# Altium project PCB_3U_Kasli.PrjPCB (part 4 of 7)

## Sheet SFP.SchDoc: =ProjectName
size 420 x 297 mm; Author: G.K.; CompanyName: WUT; DrawnBy: P.K.; Organization: WUT ISE; Address1: Warsaw Univeristy of Technology; Address2: Nowowiejska 15/19; DocumentNumber: 9; Revision: 1.1; SheetNumber: 9; SheetTotal: 12; EDA_Number: ARTIQ; Projet: ARTIQ/SINARA; ModifiedBy: -; CreateDate: XX/XX/XXXX; CheckedDate: -; Title2: SFP.SchDoc; DivGrp: ISE; Designer: G.K. and P.K.; ModifiedDate: -; ProjectName: ARTIQ/SINARA
Used 3 times, as channels U_SFP_0, U_SFP_1, U_SFP_2. Parts and nets are listed once, with the designators drawn on the sheet.
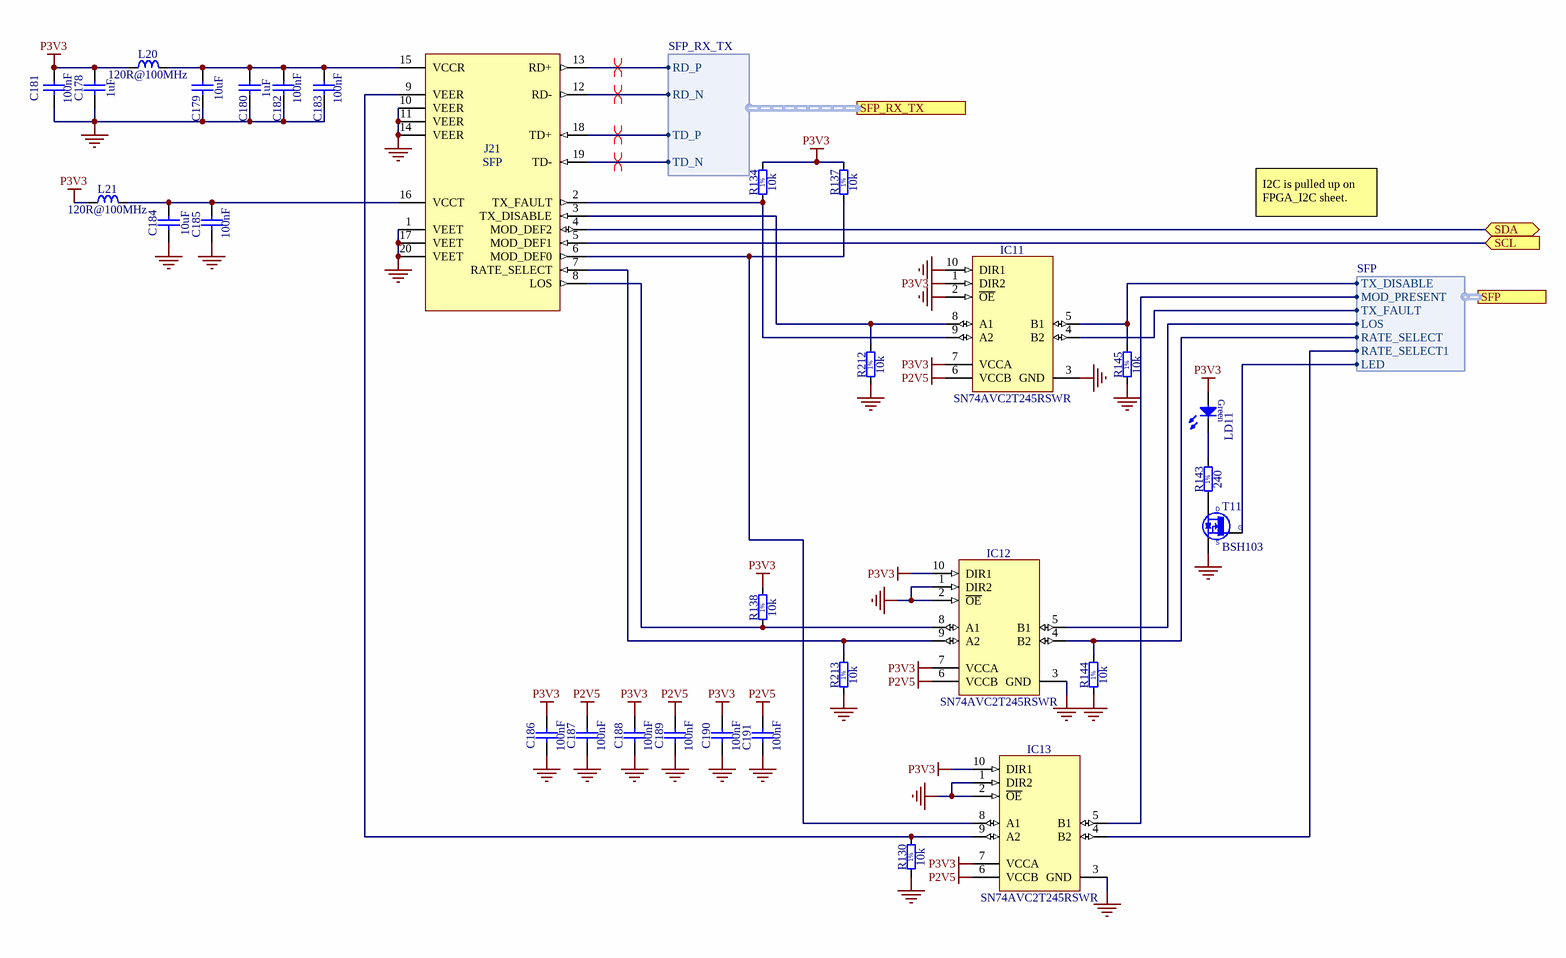
[diagram p4: SFP.SchDoc]

### Parts
C178  1uF  [CAPC1005X55N]
C179  10uF  [CAPC2012X95N]
C180  1uF  [CAPC1005X55N]
C181  100nF  [CAPC0603X33N]
C182  100nF  [CAPC0603X33N]
C183  100nF  [CAPC0603X33N]
C184  10uF  [CAPC2012X95N]
C185  100nF  [CAPC0603X33N]
C186  100nF  [CAPC0603X33N]
C187  100nF  [CAPC0603X33N]
C188  100nF  [CAPC0603X33N]
C189  100nF  [CAPC0603X33N]
C190  100nF  [CAPC0603X33N]
C191  100nF  [CAPC0603X33N]
IC11  SN74AVC2T245RSWR  [QFN40P140X180X55-10N]
IC12  SN74AVC2T245RSWR  [QFN40P140X180X55-10N]
IC13  SN74AVC2T245RSWR  [QFN40P140X180X55-10N]
J21  SFP  [TYCO_1367073-1]
L20  120R@100MHz  [INDC1608X65N]
L21  120R@100MHz  [INDC1608X65N]
LD11  Green  [LED_AVAGO_HSME-C120]  (value not drawn)
R130  10k  [RESC1005X40N]
R134  10k  [RESC1005X40N]
R137  10k  [RESC1005X40N]
R138  10k  [RESC1005X40N]
R143  240  [RESC1005X40N]
R144  10k  [RESC1005X40N]
R145  10k  [RESC1005X40N]
R212  10k  [RESC1005X40N]
R213  10k  [RESC1005X40N]
T11  BSH103  [SOT95P230X110-3N]

### Ports
SCL (in), SDA (bidir), SFP (harness SFP), SFP_RX_TX (harness SFP_RX_TX)

### Harnesses
SFP_RX_TX: RD_P, RD_N, TD_P, TD_N
SFP: TX_FAULT, LOS, MOD_PRESENT, TX_DISABLE, RATE_SELECT, LED, RATE_SELECT1

### Nets
GND: C178.1 C179.1 C180.1 C181.1 C182.1 C183.1 C184.1 C185.1 C186.1 C187.1 C188.1 C189.1 C190.1 C191.1 IC11.2(~{OE}) IC11.3(GND) IC11.10(DIR1) IC12.1(DIR2) IC12.2(~{OE}) IC12.3(GND) IC13.1(DIR2) IC13.2(~{OE}) IC13.3(GND) J21.1(VEET) J21.10(VEER) J21.11(VEER) J21.14(VEER) J21.17(VEET) J21.20(VEET) R130.1 R144.1 R145.1 R212.1 R213.1 T11.2(S)
P2V5: C187.2 C189.2 C191.2 IC11.6(VCCB) IC12.6(VCCB) IC13.6(VCCB)
P3V3: C178.2 C181.2 C186.2 C188.2 C190.2 IC11.1(DIR2) IC11.7(VCCA) IC12.7(VCCA) IC12.10(DIR1) IC13.7(VCCA) IC13.10(DIR1) L20.1 L21.1 LD11.2(A) R134.2 R137.2 R138.2
SCL: J21.5(MOD_DEF1) ; port SCL
SDA: J21.4(MOD_DEF2) ; port SDA
NetC179_2: C179.2 C180.2 C182.2 C183.2 J21.15(VCCR) L20.2
NetC184_2: C184.2 C185.2 J21.16(VCCT) L21.2
NetIC11_4: IC11.4(B2) ; port SFP.TX_FAULT
NetIC11_5: IC11.5(B1) R145.2 ; port SFP.TX_DISABLE
NetIC11_8: IC11.8(A1) J21.3(TX_DISABLE) R212.2
NetIC11_9: IC11.9(A2) J21.2(TX_FAULT) R134.1
NetIC12_4: IC12.4(B2) R144.2 ; port SFP.RATE_SELECT
NetIC12_5: IC12.5(B1) ; port SFP.LOS
NetIC12_8: IC12.8(A1) J21.8(LOS) R138.1
NetIC12_9: IC12.9(A2) J21.7(RATE_SELECT) R213.2
NetIC13_4: IC13.4(B2) ; port SFP.RATE_SELECT1
NetIC13_5: IC13.5(B1) ; port SFP.MOD_PRESENT
NetIC13_8: IC13.8(A1) J21.6(MOD_DEF0) R137.1
NetIC13_9: IC13.9(A2) J21.9(VEER) R130.2
NetJ21_12: J21.12(RD-) ; port SFP_RX_TX.RD_N
NetJ21_13: J21.13(RD+) ; port SFP_RX_TX.RD_P
NetJ21_18: J21.18(TD+) ; port SFP_RX_TX.TD_P
NetJ21_19: J21.19(TD-) ; port SFP_RX_TX.TD_N
NetLD11_1: LD11.1(C) R143.2
NetR143_1: R143.1 T11.3(D)
NetT11_1: T11.1(G) ; port SFP.LED

### Channels
U_SFP_0: designators end in A; ports SCL=SFP_0.SCL SDA=SFP_0.SDA
U_SFP_1: designators end in B; ports SCL=SFP_1.SCL SDA=SFP_1.SDA
U_SFP_2: designators end in C; ports SCL=SFP_2.SCL SDA=SFP_2.SDA

### Layout directives
differential pair; net class Diff_100Ohm: SFP_RX_TX_0.RD_N, SFP_RX_TX_0.RD_P, SFP_RX_TX_0.TD_N, SFP_RX_TX_0.TD_P

### Notes on the sheet
- I2C is pulled up on FPGA_I2C sheet.
- Project/Equipment
- Document
- Designer
- Drawn by
- Check.by
- File
- Last Mod.
- Print Date
- Sheet
- Size
- A3
- of
- Rev
- (in symbol R0402_10K_1%_0.0625W_100PPM) 1%
- (in symbol R0402_240R_1%_0.0625W_100PPM) 1%

### Library data of the parts
C178 C180 = CC0402_1UF_16V_10%_X5R: as C154 on sheet PowerSupplies; Part Number: CC0402_1UF_16V_10%_X5R; Component Kind: Standard; Component Type: Standard; Pin Count: 2; Value: 1uF; Status: Preferred; Manufacturer Part Number: CC0402_1UF_16V_10%_X5R; Case: 0402; Mounted: Yes; Socket: No; SMD: Yes; Sense: No; Manufacturer1 Example: TDK; Manufacturer1 ComponentHeight: 0.55mm; HelpURL: \\cern.ch\dfs\Applications\Altium\Datasheets\CC0402_X5R_TDK_C.pdf; Author: CERN DEM JLC; CreateDate: 2012-10-25; LatestRevisionDate: 2012-10-25
C179 C184 = CC0805_10UF_25V_10%_X5R: as C130 on sheet PowerSupplies; Part Number: CC0805_10UF_25V_10%_X5R; Component Kind: Standard; Component Type: Standard; Pin Count: 2; Value: 10uF; Status: Preferred; Manufacturer Part Number: CC0805_10UF_25V_10%_X5R; Case: 0805; Mounted: Yes; Socket: No; SMD: Yes; Sense: No; Manufacturer1 Example: MURATA; Manufacturer1 ComponentHeight: 0.95mm; HelpURL: \\cern.ch\dfs\Applications\Altium\Datasheets\CC0805_X5R_MURATA_GRM.pdf; Author: CERN DEM JLC; CreateDate: 25.10.2012; LatestRevisionDate: 06.09.2016
C181-C183 C185-C191 = CC0201_100NF_6.3V_10%_X5R: as C134 on sheet PowerSupplies; Part Number: CC0201_100NF_6.3V_10%_X5R; Component Kind: Standard; Component Type: Standard; Pin Count: 2; Value: 100nF; Status: Not Recommended; Manufacturer Part Number: CC0201_100NF_6.3V_10%_X5R; Case: 0201; Mounted: Yes; Socket: No; SMD: Yes; Sense: No; Manufacturer1 Example: AVX; Manufacturer1 ComponentHeight: 0.33mm; HelpURL: \\cern.ch\dfs\Applications\Altium\Datasheets\CC0201_X5R_AVX.pdf; Author: CERN DEM JLC; CreateDate: 2007-12-03; LatestRevisionDate: 2007-12-03
IC11-IC13 = SN74AVC2T245RSWR: Dual-Bit Dual-Supply Bus Transceiver With Configurable Voltage Translation and 3-State Outputs; Manufacturer: TEXAS INSTRUMENTS; PressFit: No; Bonding: No; Part Number: SN74AVC2T245RSWR; Component Kind: Standard; Component Type: Standard; Device: SN74AVC2T245RSWR; PackageDescription: QFN, 0.40mm Pitch, Rect.;10 Pin, 1.80mm L X 1.40mm W X 0.55mm H Body, IPC Medium Density; Status: Not Recommended; Part Description: Dual-Bit Dual-Supply Bus Transceiver With Configurable Voltage Translation and 3-State Outputs; Manufacturer Part Number: SN74AVC2T245RSWR; Pin Count: 10; Case: QFN10; Mounted: Yes; Socket: No; SMD: Yes; Sense: No; ComponentHeight: 0.55mm; Author: CERN DEM JLC; HelpURL: \\cern.ch\dfs\Applications\Altium\Datasheets\SN74AVC2T245RSWR.pdf; CreateDate: 07.07.2014; LatestRevisionDate: 30.03.2017
J21 = TYCO_1367073-1: 20 Position SFP  Connector (Small Form-factor Pluggable); Part Description: 20 Position, Pitch 0.8mm SFP Receptacle (Small Form-factor Pluggable); Manufacturer: TYCO ELECTRONICS; PressFit: No; Part Number: TYCO_1367073-1; Component Kind: Standard; Component Type: Standard; Pin Count: 20; Family: SFP; Mounted: Yes; Socket: No; SMD: Yes; Sense: No; Status: None; Manufacturer Part Number: 1367073-1; ComponentHeight: 5.4mm; ComponentLink1URL: \\cern.ch\dfs\Applications\Altium\Datasheets\TYCO_SFP_Application.pdf; ComponentLink1Description: Application; ComponentLink2URL: \\cern.ch\dfs\Applications\Altium\Datasheets\Tyco_SFP_Specification.pdf; ComponentLink2Description: SFP Specification; HelpURL: \\cern.ch\dfs\Applications\Altium\Datasheets\TYCO_1367073-1.pdf; Author: CERN DEM JLC; CreateDate: 25.01.2010; LatestRevisionDate: 25.01.2010
L20 L21 = IND0603_MURATA_BLM18SG121TN1D: as L7 on sheet PowerSupplies; Part Number: IND0603_MURATA_BLM18SG121TN1D; Component Kind: Standard; Component Type: Standard; Pin Count: 2; Value: 120R@100MHz; Status: None; Manufacturer Part Number: BLM18SG121TN1D; Case: 0603; Mounted: Yes; Socket: No; SMD: Yes; Sense: No; ComponentHeight: 0.65mm; HelpURL: \\cern.ch\dfs\Applications\Altium\Datasheets\IND0603_MURATA_BLM18S.pdf; Author: CERN DEM JLC; CreateDate: 23.07.2014; LatestRevisionDate: 23.07.2014
LD11 = LED_AVAGO_HSME-C120: LED Green 1C 2A; Part Description: High Performance Right Angle Chip Green LED; Manufacturer: AVAGO TECHNOLOGIES; PressFit: No; Bonding: No; Part Number: LED_AVAGO_HSME-C120; Component Kind: Standard; Component Type: Standard; Color: Green; PackageDescription: Green Chip LED, 2-Leads, Body 1.7x1.1mm, Side Emitting Package; Manufacturer Part Number: HSME-C120; Pin Count: 2; Mounted: Yes; Socket: No; SMD: Yes; Sense: No; ComponentHeight: 0.7mm; HelpURL: \\cern.ch\dfs\Applications\Altium\Datasheets\LED_AVAGO_HSME-C120.pdf; ComponentLink1URL: \\cern.ch\dfs\Applications\Altium\Datasheets\LED_AVAGO_HSME-C110_DESIGN-GUIDE.pdf; ComponentLink1Description: Design Guide; Author: CERN DEM JMW; CreateDate: 22.07.2009; LatestRevisionDate: 20.06.2012
R130 R134 R137 R138 R144 R145 R212 R213 = R0402_10K_1%_0.0625W_100PPM: as R51 on sheet PowerSupplies; Part Number: R0402_10K_1%_0.0625W_100PPM; Component Kind: Standard; Component Type: Standard; Pin Count: 2; Value: 10k; Status: Not Recommended; Power: 0.0625W; Tolerance: ±1%; Manufacturer Part Number: R0402_10K_1%_0.0625W_100PPM; Case: 0402; Mounted: Yes; Sense: No; Socket: No; SMD: Yes; Manufacturer1 Example: YAGEO PHYCOMP; Manufacturer1 ComponentHeight: 0.4mm; HelpURL: \\cern.ch\dfs\Applications\Altium\Datasheets\R0402_Phycomp_RC0402.pdf; Author: CERN DEM JLC; CreateDate: 03.12.2007; LatestRevisionDate: 17.10.2012
R143 = R0402_240R_1%_0.0625W_100PPM: as R69 on sheet PowerSupplies; Part Number: R0402_240R_1%_0.0625W_100PPM; Component Kind: Standard; Component Type: Standard; Pin Count: 2; Value: 240; Status: Not Recommended; Power: 0.0625W; Tolerance: ±1%; Manufacturer Part Number: R0402_240R_1%_0.0625W_100PPM; Case: 0402; Mounted: Yes; Sense: No; Socket: No; SMD: Yes; Manufacturer1 Example: YAGEO PHYCOMP; Manufacturer1 ComponentHeight: 0.4mm; HelpURL: \\cern.ch\dfs\Applications\Altium\Datasheets\R0402_Phycomp_RC0402.pdf; Author: CERN DEM JLC; CreateDate: 03.12.2007; LatestRevisionDate: 17.10.2012
T11 = BSH103: as T6-T10 on sheet PowerSupplies; Part Number: BSH103; Component Kind: Standard; Component Type: Standard; Device: BSH103; PackageDescription: SOT23, 3 pin, Pitch 0.95mm - 1.3mm W X 2.9mm L X 1.1mm H, IPC Medium Density; Manufacturer Part Number: BSH103; Pin Count: 3; Case: SOT23-3; Mounted: Yes; Socket: No; SMD: Yes; Sense: No; ComponentHeight: 1.1mm; HelpURL: \\cern.ch\dfs\Applications\Altium\Datasheets\BSH103.pdf; Author: CERN DEM JLC; CreateDate: 16.03.2010; LatestRevisionDate: 20.06.2017

## Sheet BackplaneConnector.SchDoc: =ProjectName
size 420 x 297 mm; Author: G.K.; CompanyName: WUT; DrawnBy: G.K. and P.K.; Organization: WUT ISE; Address1: Warsaw Univeristy of Technology; Address2: Nowowiejska 15/19; DocumentNumber: 7; Revision: 1.1; SheetNumber: 7; SheetTotal: 12; EDA_Number: ARTIQ; Projet: ARTIQ/SINARA; ModifiedBy: -; CreateDate: XX/XX/XXXX; CheckedDate: -; Title2: BackplaneConnector.SchDoc; DivGrp: ISE; Designer: G.K.; ModifiedDate: -; ProjectName: ARTIQ/SINARA
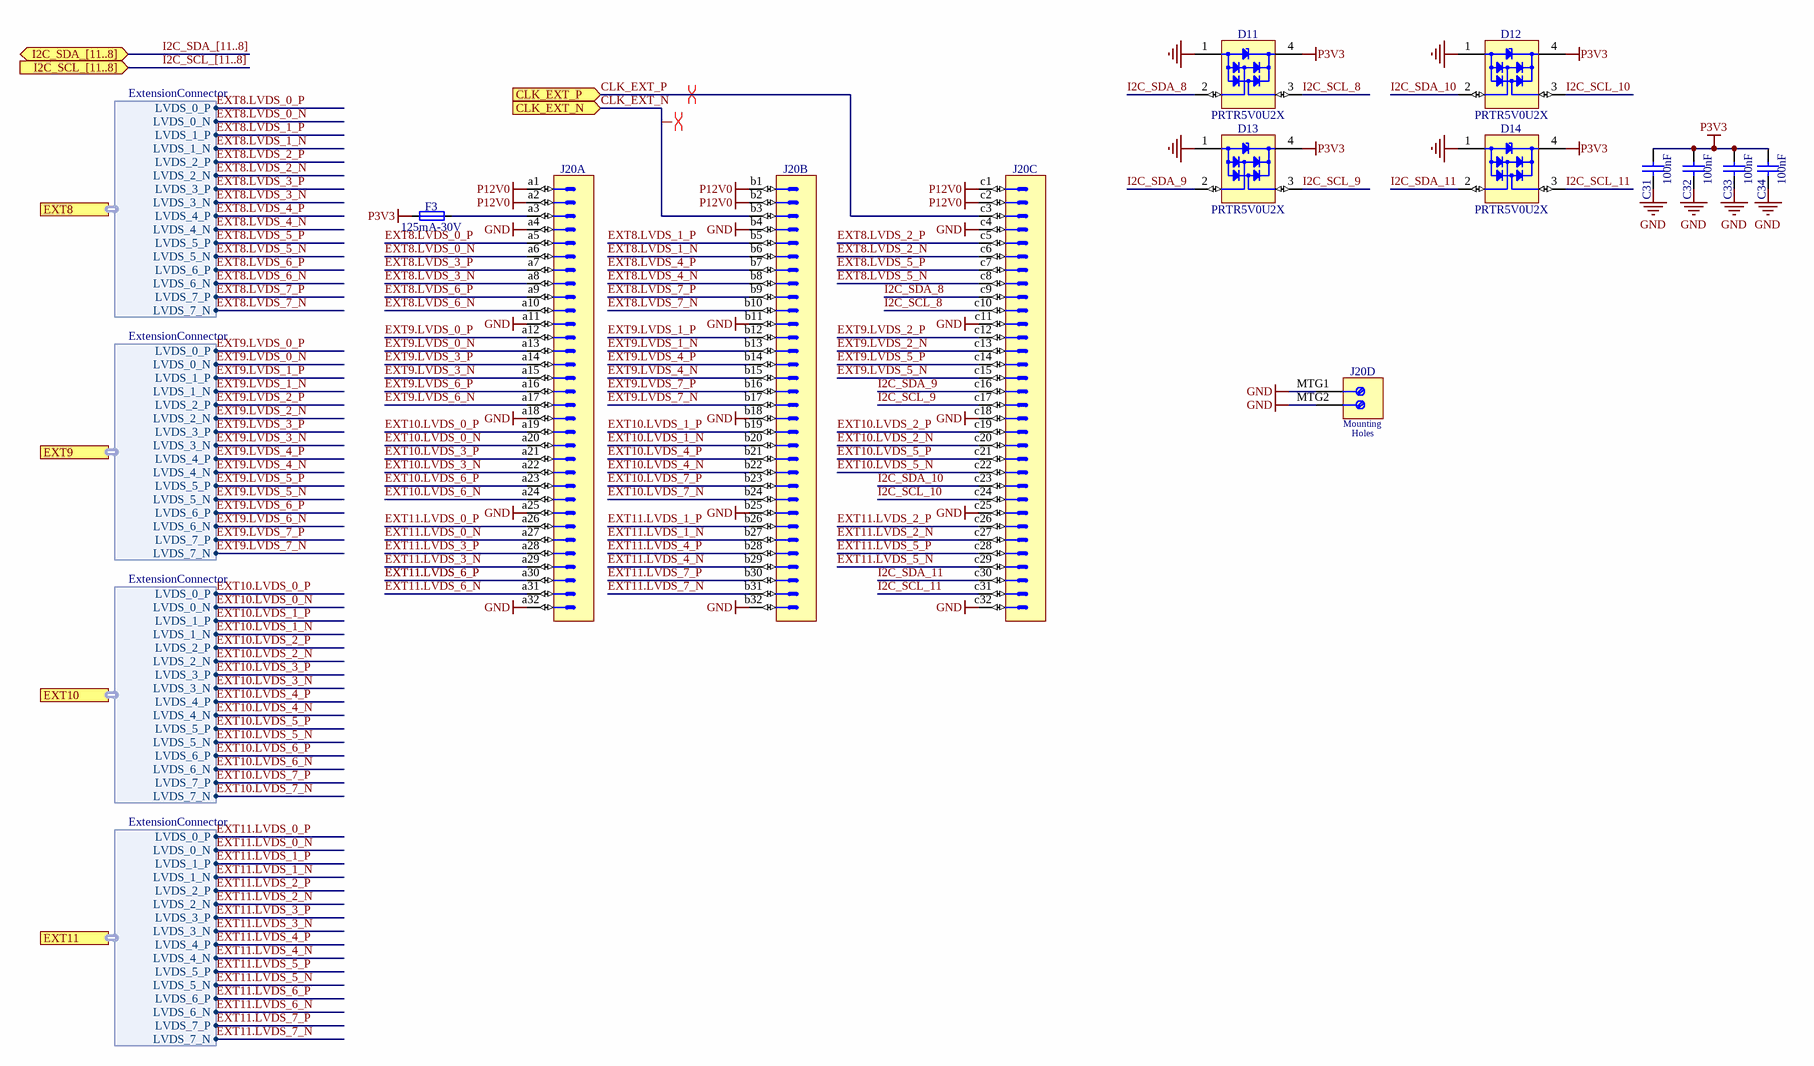
[diagram p5: BackplaneConnector.SchDoc]

### Parts
C31  100nF  [CAPC0603X33N]
C32  100nF  [CAPC0603X33N]
C33  100nF  [CAPC0603X33N]
C34  100nF  [CAPC0603X33N]
D11  PRTR5V0U2X  [SOT190P230X110-4N]
D12  PRTR5V0U2X  [SOT190P230X110-4N]
D13  PRTR5V0U2X  [SOT190P230X110-4N]
D14  PRTR5V0U2X  [SOT190P230X110-4N]
F3  125mA-30V  [FUSR_LITTELFUSE_1206L012]
J20  DIN 41612 Type C  [HARTING_09 03 196 2921]  (value not drawn)  (parts A,B,C,D of 4)

### Ports
CLK_EXT_N (in), CLK_EXT_P (in), EXT8 (harness ExtensionConnector), EXT9 (harness ExtensionConnector), EXT10 (harness ExtensionConnector), EXT11 (harness ExtensionConnector), I2C_SCL_[11..8] (in), I2C_SDA_[11..8] (bidir)

### Harnesses
ExtensionConnector: LVDS_0_N, LVDS_0_P, LVDS_1_N, LVDS_1_P, LVDS_2_N, LVDS_2_P, LVDS_3_N, LVDS_3_P, LVDS_4_N, LVDS_4_P, LVDS_5_N, LVDS_5_P, LVDS_6_N, LVDS_6_P, LVDS_7_N, LVDS_7_P

### Nets
GND: C31.1 C32.1 C33.1 C34.1 D11.1(GND) D12.1(GND) D13.1(GND) D14.1(GND) J20.a4 J20.a11 J20.a18 J20.a25 J20.a32 J20.b4 J20.b11 J20.b18 J20.b25 J20.b32 J20.c4 J20.c11 J20.c18 J20.c25 J20.c32 J20.MTG1 J20.MTG2
P3V3: C31.2 C32.2 C33.2 C34.2 D11.4(VCC) D12.4(VCC) D13.4(VCC) D14.4(VCC) F3.1
P12V0: J20.a1 J20.a2 J20.b1 J20.b2 J20.c1 J20.c2
CLK_EXT_N: J20.b3 ; port CLK_EXT_N
CLK_EXT_P: J20.c3 ; port CLK_EXT_P
EXT8.LVDS_0_N: J20.a6 ; port EXT8.LVDS_0_N
EXT8.LVDS_0_P: J20.a5 ; port EXT8.LVDS_0_P
EXT8.LVDS_1_N: J20.b6 ; port EXT8.LVDS_1_N
EXT8.LVDS_1_P: J20.b5 ; port EXT8.LVDS_1_P
EXT8.LVDS_2_N: J20.c6 ; port EXT8.LVDS_2_N
EXT8.LVDS_2_P: J20.c5 ; port EXT8.LVDS_2_P
EXT8.LVDS_3_N: J20.a8 ; port EXT8.LVDS_3_N
EXT8.LVDS_3_P: J20.a7 ; port EXT8.LVDS_3_P
EXT8.LVDS_4_N: J20.b8 ; port EXT8.LVDS_4_N
EXT8.LVDS_4_P: J20.b7 ; port EXT8.LVDS_4_P
EXT8.LVDS_5_N: J20.c8 ; port EXT8.LVDS_5_N
EXT8.LVDS_5_P: J20.c7 ; port EXT8.LVDS_5_P
EXT8.LVDS_6_N: J20.a10 ; port EXT8.LVDS_6_N
EXT8.LVDS_6_P: J20.a9 ; port EXT8.LVDS_6_P
EXT8.LVDS_7_N: J20.b10 ; port EXT8.LVDS_7_N
EXT8.LVDS_7_P: J20.b9 ; port EXT8.LVDS_7_P
EXT9.LVDS_0_N: J20.a13 ; port EXT9.LVDS_0_N
EXT9.LVDS_0_P: J20.a12 ; port EXT9.LVDS_0_P
EXT9.LVDS_1_N: J20.b13 ; port EXT9.LVDS_1_N
EXT9.LVDS_1_P: J20.b12 ; port EXT9.LVDS_1_P
EXT9.LVDS_2_N: J20.c13 ; port EXT9.LVDS_2_N
EXT9.LVDS_2_P: J20.c12 ; port EXT9.LVDS_2_P
EXT9.LVDS_3_N: J20.a15 ; port EXT9.LVDS_3_N
EXT9.LVDS_3_P: J20.a14 ; port EXT9.LVDS_3_P
EXT9.LVDS_4_N: J20.b15 ; port EXT9.LVDS_4_N
EXT9.LVDS_4_P: J20.b14 ; port EXT9.LVDS_4_P
EXT9.LVDS_5_N: J20.c15 ; port EXT9.LVDS_5_N
EXT9.LVDS_5_P: J20.c14 ; port EXT9.LVDS_5_P
EXT9.LVDS_6_N: J20.a17 ; port EXT9.LVDS_6_N
EXT9.LVDS_6_P: J20.a16 ; port EXT9.LVDS_6_P
EXT9.LVDS_7_N: J20.b17 ; port EXT9.LVDS_7_N
EXT9.LVDS_7_P: J20.b16 ; port EXT9.LVDS_7_P
EXT10.LVDS_0_N: J20.a20 ; port EXT10.LVDS_0_N
EXT10.LVDS_0_P: J20.a19 ; port EXT10.LVDS_0_P
EXT10.LVDS_1_N: J20.b20 ; port EXT10.LVDS_1_N
EXT10.LVDS_1_P: J20.b19 ; port EXT10.LVDS_1_P
EXT10.LVDS_2_N: J20.c20 ; port EXT10.LVDS_2_N
EXT10.LVDS_2_P: J20.c19 ; port EXT10.LVDS_2_P
EXT10.LVDS_3_N: J20.a22 ; port EXT10.LVDS_3_N
EXT10.LVDS_3_P: J20.a21 ; port EXT10.LVDS_3_P
EXT10.LVDS_4_N: J20.b22 ; port EXT10.LVDS_4_N
EXT10.LVDS_4_P: J20.b21 ; port EXT10.LVDS_4_P
EXT10.LVDS_5_N: J20.c22 ; port EXT10.LVDS_5_N
EXT10.LVDS_5_P: J20.c21 ; port EXT10.LVDS_5_P
EXT10.LVDS_6_N: J20.a24 ; port EXT10.LVDS_6_N
EXT10.LVDS_6_P: J20.a23 ; port EXT10.LVDS_6_P
EXT10.LVDS_7_N: J20.b24 ; port EXT10.LVDS_7_N
EXT10.LVDS_7_P: J20.b23 ; port EXT10.LVDS_7_P
EXT11.LVDS_0_N: J20.a27 ; port EXT11.LVDS_0_N
EXT11.LVDS_0_P: J20.a26 ; port EXT11.LVDS_0_P
EXT11.LVDS_1_N: J20.b27 ; port EXT11.LVDS_1_N
EXT11.LVDS_1_P: J20.b26 ; port EXT11.LVDS_1_P
EXT11.LVDS_2_N: J20.c27 ; port EXT11.LVDS_2_N
EXT11.LVDS_2_P: J20.c26 ; port EXT11.LVDS_2_P
EXT11.LVDS_3_N: J20.a29 ; port EXT11.LVDS_3_N
EXT11.LVDS_3_P: J20.a28 ; port EXT11.LVDS_3_P
EXT11.LVDS_4_N: J20.b29 ; port EXT11.LVDS_4_N
EXT11.LVDS_4_P: J20.b28 ; port EXT11.LVDS_4_P
EXT11.LVDS_5_N: J20.c29 ; port EXT11.LVDS_5_N
EXT11.LVDS_5_P: J20.c28 ; port EXT11.LVDS_5_P
EXT11.LVDS_6_N: J20.a31 ; port EXT11.LVDS_6_N
EXT11.LVDS_6_P: J20.a30 ; port EXT11.LVDS_6_P
EXT11.LVDS_7_N: J20.b31 ; port EXT11.LVDS_7_N
EXT11.LVDS_7_P: J20.b30 ; port EXT11.LVDS_7_P
I2C_SCL_8: D11.3(I/O2) J20.c10
I2C_SCL_9: D13.3(I/O2) J20.c17
I2C_SCL_10: D12.3(I/O2) J20.c24
I2C_SCL_11: D14.3(I/O2) J20.c31
I2C_SDA_8: D11.2(I/O1) J20.c9
I2C_SDA_9: D13.2(I/O1) J20.c16
I2C_SDA_10: D12.2(I/O1) J20.c23
I2C_SDA_11: D14.2(I/O1) J20.c30
NetF3_2: F3.2 J20.a3

### Buses and harness runs
bus I2C_SCL_[11..8] = port I2C_SCL_[11..8]
bus I2C_SDA_[11..8] = port I2C_SDA_[11..8]

### Layout directives
differential pair: CLK_EXT_N, CLK_EXT_P

### Notes on the sheet
- Project/Equipment
- Document
- Designer
- Drawn by
- Check.by
- File
- Last Mod.
- Print Date
- Sheet
- Size
- A3
- of
- Rev
- (in symbol HARTING_09 03 196 2921, part D) Mounting; Holes

### Library data of the parts
C31-C34 = CC0201_100NF_6.3V_10%_X5R: as C134 on sheet PowerSupplies; Part Number: CC0201_100NF_6.3V_10%_X5R; Component Kind: Standard; Component Type: Standard; Pin Count: 2; Value: 100nF; Status: Not Recommended; Manufacturer Part Number: CC0201_100NF_6.3V_10%_X5R; Case: 0201; Mounted: Yes; Socket: No; SMD: Yes; Sense: No; Manufacturer1 Example: AVX; Manufacturer1 ComponentHeight: 0.33mm; HelpURL: \\cern.ch\dfs\Applications\Altium\Datasheets\CC0201_X5R_AVX.pdf; Author: CERN DEM JLC; CreateDate: 2007-12-03; LatestRevisionDate: 2007-12-03
D11-D14 = PRTR5V0U2X: Ultra Low Capacitance Double Rail-to-Rail ESD Protection Diode; Part Description: Ultra Low Capacitance (1pF) Double Rail-to-Rail ESD Protection Diode (8kV); Manufacturer: NXP SEMICONDUCTORS; Voltage: 5.5V; PressFit: No; Bonding: No; Part Number: PRTR5V0U2X; Component Kind: Standard; Component Type: Standard; Device: PRTR5V0U2X; PackageDescription: SOT143B, SOT, 1.90mm Pitch; 4 Pin, 1.30mm W X 2.90mm L X 1.10mm H body, IPC Medium Density; Manufacturer Part Number: PRTR5V0U2X; Pin Count: 4; Case: SOT143B; Mounted: Yes; Socket: No; SMD: Yes; Sense: No; ComponentHeight: 1.1mm; HelpURL: \\cern.ch\dfs\Applications\Altium\Datasheets\PRTR5V0U2X.pdf; Author: CERN DEM JLC; CreateDate: 22.03.2011; LatestRevisionDate: 22.03.2011
F3 = FUSR_LITTELFUSE_1206L012: Fuse; Part Description: POLYFUSE® Surface Mount Resettable PTC; Manufacturer Part Number: 1206L012WR; PressFit: No; Part Number: FUSR_LITTELFUSE_1206L012; Component Kind: Standard; Component Type: Standard; Pin Count: 2; PackageDescription: Surface Mount POLY-FUSE® Resettable PTC, 1206L Series; Family: Fuses Resettable; Mounted: Yes; Socket: No; SMD: Yes; Sense: No; Value: 125mA-30V; Manufacturer: LITTELFUSE; ComponentHeight: 1.45mm; HelpURL: \\cern.ch\dfs\Applications\Altium\Datasheets\FUSR_LITTELFUSE_1206L012.pdf; Author: CERN DEM JLC; CreateDate: 19.12.2011; LatestRevisionDate: 19.12.2011
J20 = HARTING_09 03 196 2921: Connector 96abc male (3x32); Part Description: DIN 41612, Type C, 96 Position, Rows a+b+c, Performance level 1, Right Angle Male Connector, Lead 3.0 mm, Pitch 2.54mm; PressFit: No; Part Number: HARTING_09 03 196 2921; Component Kind: Standard; Component Type: Standard; Pin Count: 98; Family: DIN 41612 Type C; Mounted: Yes; Socket: No; SMD: No; Sense: No; Status: None; Manufacturer: HARTING; Manufacturer Part Number: 09 03 196 2921; ComponentHeight: 11mm; HelpURL: \\cern.ch\dfs\Applications\Altium\Datasheets\HARTING_09 03 196 2921.pdf; Author: CERN DEM JLC; CreateDate: 16.04.2008; LatestRevisionDate: 25.02.2013; ClassName: Connectors

## Sheet FPGAPower&Misc.SchDoc: =ProjectName
size 420 x 297 mm; Author: G.K.; CompanyName: WUT; DrawnBy: P.K.; Organization: WUT ISE; Address1: Warsaw Univeristy of Technology; Address2: Nowowiejska 15/19; DocumentNumber: 5; Revision: 1.1; SheetNumber: 5; SheetTotal: 12; EDA_Number: ARTIQ; Projet: ARTIQ/SINARA; ModifiedBy: -; CreateDate: XX/XX/XXXX; CheckedDate: -; Title2: FPGAPower&Misc.SchDoc; DivGrp: ISE; Designer: G.K. and P.K.; ModifiedDate: -; ProjectName: ARTIQ/SINARA
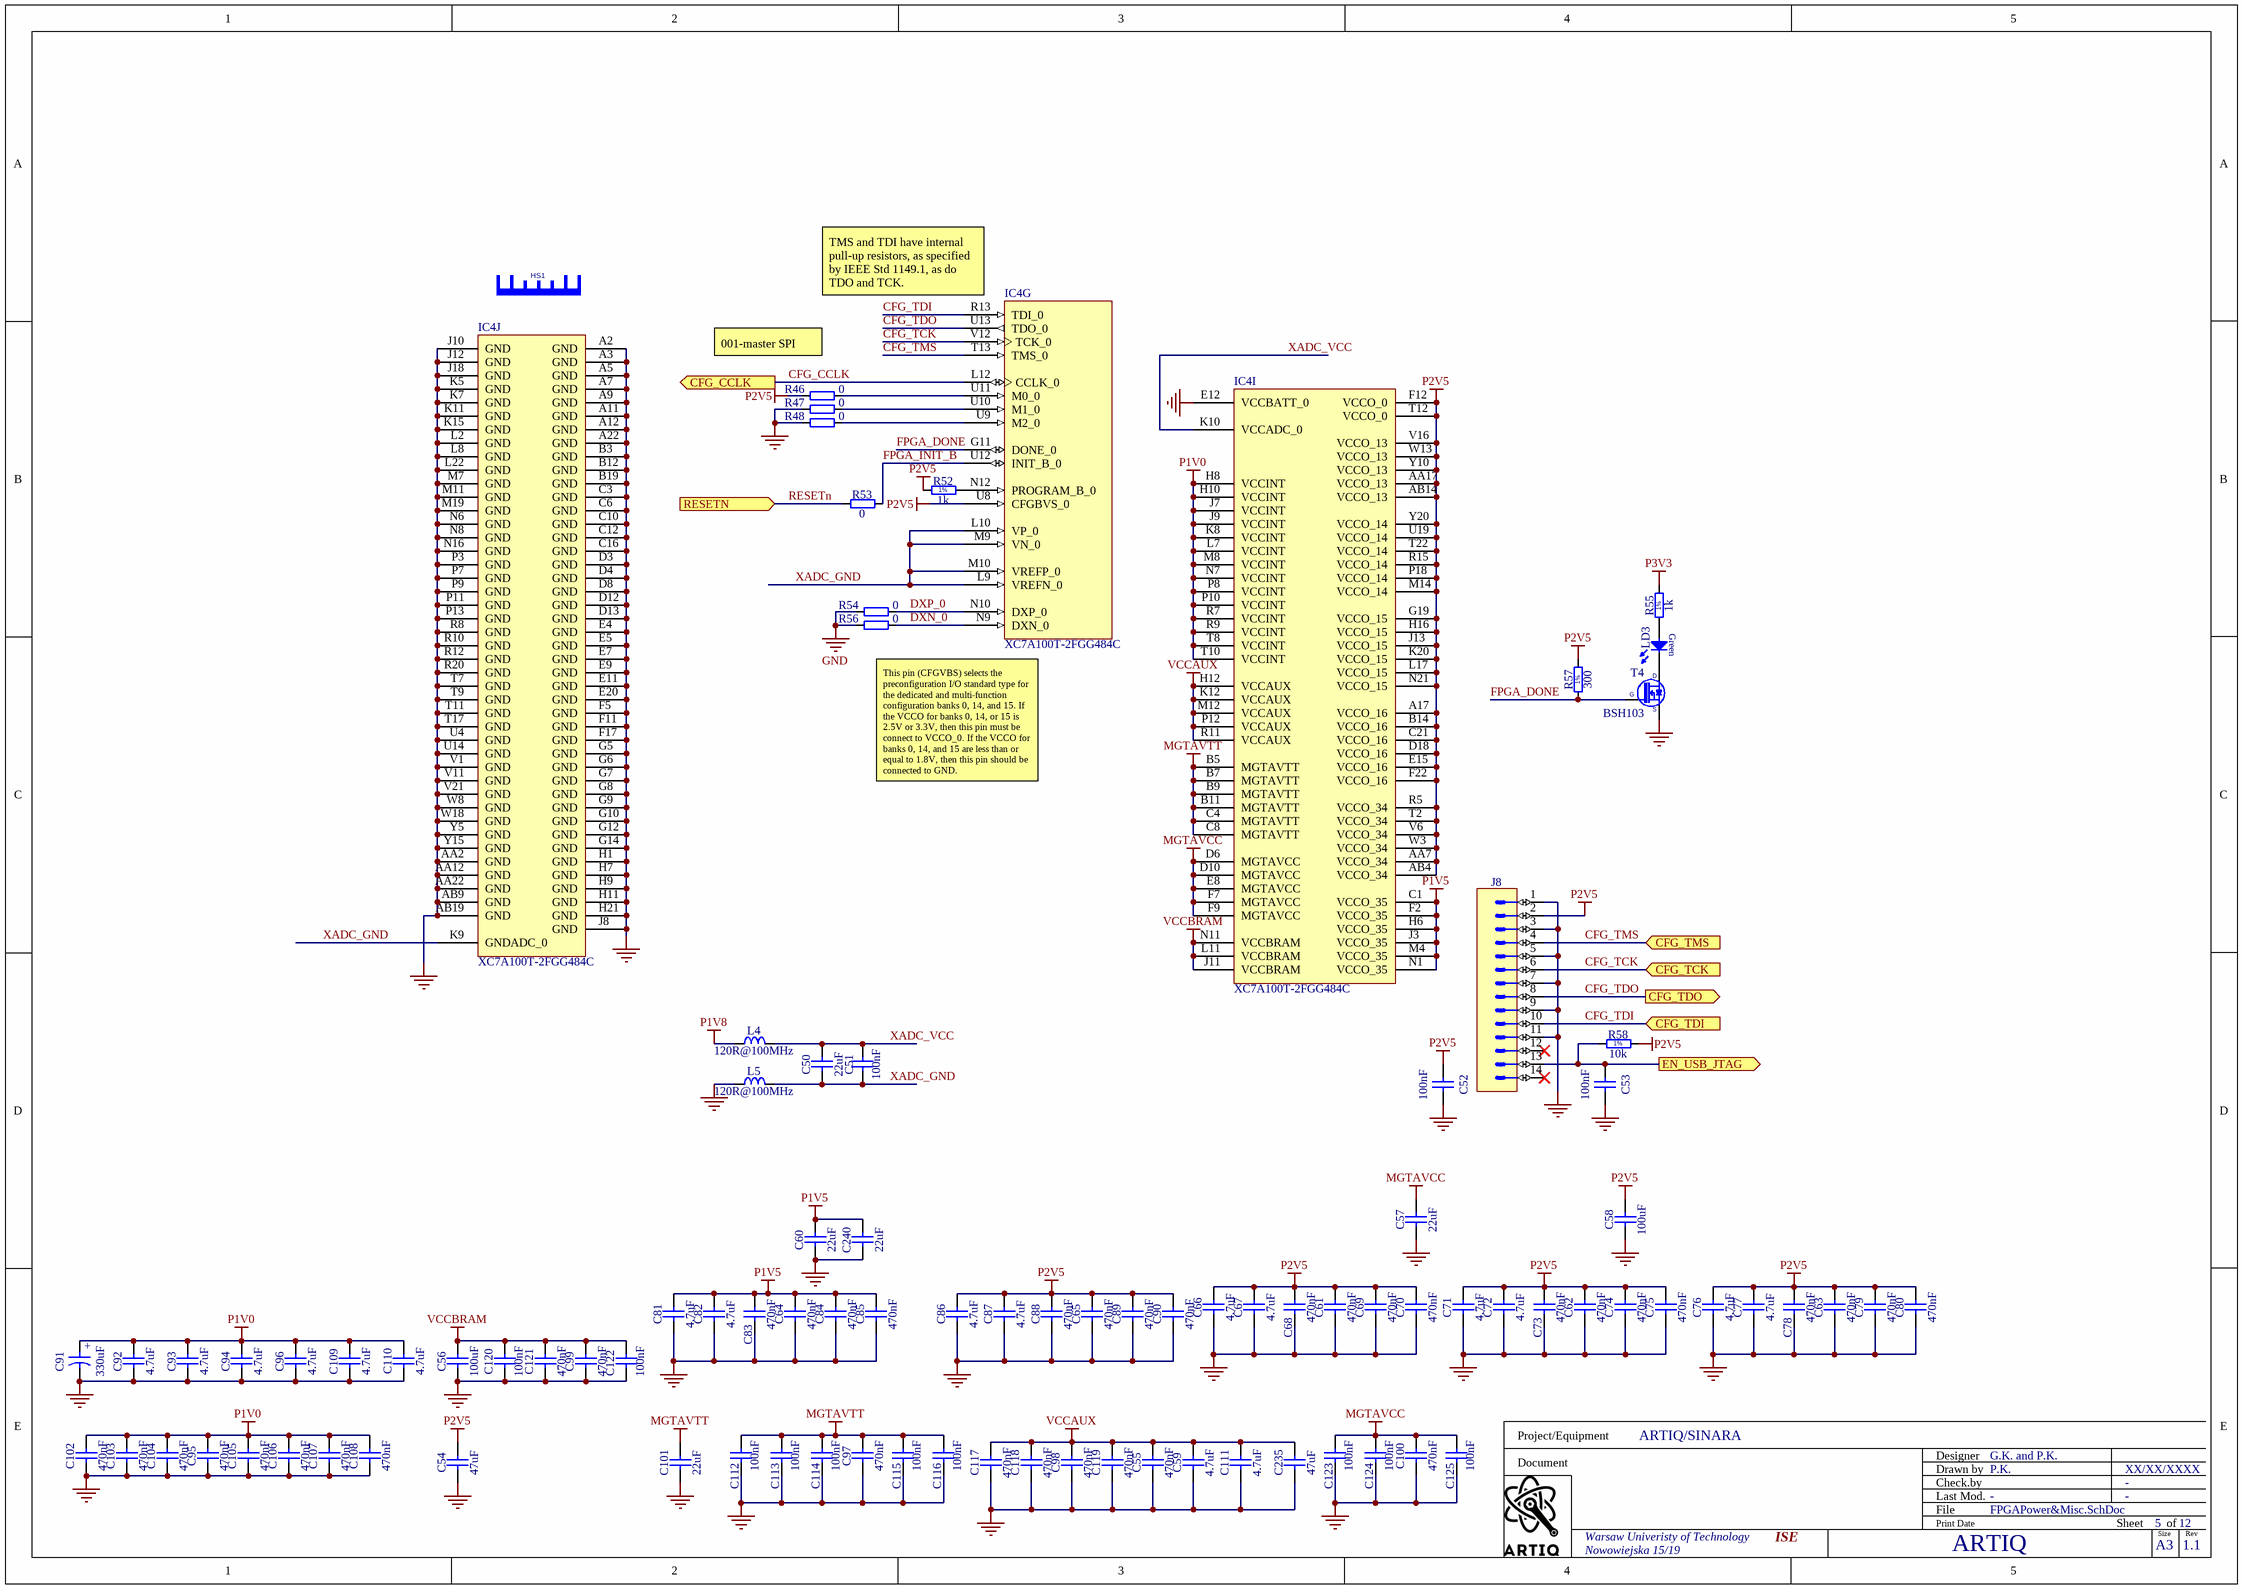
[diagram p6: FPGAPower&Misc.SchDoc]

### Parts
C50  22uF  [CAPC1709X100N]
C51  100nF  [CAPC0603X33N]
C52  100nF  [CAPC0603X33N]
C53  100nF  [CAPC0603X33N]
C54  47uF  [CAPC3225X270N]
C55  470nF  [CAPC0603X33N]
C56  100uF  [CAPC3225X270N]
C57  22uF  [CAPC1709X100N]
C58  100uF  [CAPC3225X270N]
C59  4.7uF  [CAPC2012X135N]
C60  22uF  [CAPC1709X100N]
C61  470nF  [CAPC0603X33N]
C62  470nF  [CAPC0603X33N]
C63  470nF  [CAPC0603X33N]
C64  470nF  [CAPC0603X33N]
C65  470nF  [CAPC0603X33N]
C66  4.7uF  [CAPC2012X135N]
C67  4.7uF  [CAPC2012X135N]
C68  470nF  [CAPC0603X33N]
C69  470nF  [CAPC0603X33N]
C70  470nF  [CAPC0603X33N]
C71  4.7uF  [CAPC2012X135N]
C72  4.7uF  [CAPC2012X135N]
C73  470nF  [CAPC0603X33N]
C74  470nF  [CAPC0603X33N]
C75  470nF  [CAPC0603X33N]
C76  4.7uF  [CAPC2012X135N]
C77  4.7uF  [CAPC2012X135N]
C78  470nF  [CAPC0603X33N]
C79  470nF  [CAPC0603X33N]
C80  470nF  [CAPC0603X33N]
C81  4.7uF  [CAPC2012X135N]
C82  4.7uF  [CAPC2012X135N]
C83  470nF  [CAPC0603X33N]
C84  470nF  [CAPC0603X33N]
C85  470nF  [CAPC0603X33N]
C86  4.7uF  [CAPC2012X135N]
C87  4.7uF  [CAPC2012X135N]
C88  470nF  [CAPC0603X33N]
C89  470nF  [CAPC0603X33N]
C90  470nF  [CAPC0603X33N]
C91  330uF  [CAPMP7343X190N]
C92  4.7uF  [CAPC2012X135N]
C93  4.7uF  [CAPC2012X135N]
C94  4.7uF  [CAPC2012X135N]
C95  470nF  [CAPC0603X33N]
C96  4.7uF  [CAPC2012X135N]
C97  470nF  [CAPC0603X33N]
C98  470nF  [CAPC0603X33N]
C99  470nF  [CAPC0603X33N]
C100  470nF  [CAPC0603X33N]
C101  22uF  [CAPC1709X100N]
C102  470nF  [CAPC0603X33N]
C103  470nF  [CAPC0603X33N]
C104  470nF  [CAPC0603X33N]
C105  470nF  [CAPC0603X33N]
C106  470nF  [CAPC0603X33N]
C107  470nF  [CAPC0603X33N]
C108  470nF  [CAPC0603X33N]
C109  4.7uF  [CAPC2012X135N]
C110  4.7uF  [CAPC2012X135N]
C111  4.7uF  [CAPC2012X135N]
C112  100nF  [CAPC0603X33N]
C113  100nF  [CAPC0603X33N]
C114  100nF  [CAPC0603X33N]
C115  100nF  [CAPC0603X33N]
C116  100nF  [CAPC0603X33N]
C117  470nF  [CAPC0603X33N]
C118  470nF  [CAPC0603X33N]
C119  470nF  [CAPC0603X33N]
C120  100nF  [CAPC0603X33N]
C121  470nF  [CAPC0603X33N]
C122  100nF  [CAPC0603X33N]
C123  100nF  [CAPC0603X33N]
C124  100nF  [CAPC0603X33N]
C125  100nF  [CAPC0603X33N]
C235  47uF  [CAPC3225X270N]
C240  22uF  [CAPC1709X100N]
HS1  Heat Sink No Pad  [ICK BGA 23 x 23 x 10]  (value not drawn)
IC4  XC7A100T-2FGG484C  [FGG484]  (parts G,I,J of 10)
J8  Milli-Grid™  [MOLEX_87831-1420]  (value not drawn)
L4  120R@100MHz  [INDC1608X65N]
L5  120R@100MHz  [INDC1608X65N]
LD3  (no value)  [LED_KINGBRIGHT_KPH-1608CGCK]
R46  0  [RESC1005X40N]
R47  0  [RESC1005X40N]
R48  0  [RESC1005X40N]
R52  1k  [RESC1005X40N]
R53  0  [RESC1005X40N]
R54  0  [RESC1005X40N]
R55  1k  [RESC1005X40N]
R56  0  [RESC1005X40N]
R57  300  [RESC1005X40N]
R58  10k  [RESC1005X40N]
T4  BSH103  [SOT95P230X110-3N]

### Ports
CFG_CCLK (out), CFG_TCK (in), CFG_TDI (in), CFG_TDO (out), CFG_TMS (in), EN_USB_JTAG (out), RESETN (in)

### Nets
GND: C52.1 C53.1 C54.1 C55.1 C56.1 C57.1 C58.1 C59.1 C60.1 C61.1 C62.1 C63.1 C64.1 C65.1 C66.1 C67.1 C68.1 C69.1 C70.1 C71.1 C72.1 C73.1 C74.1 C75.1 C76.1 C77.1 C78.1 C79.1 C80.1 C81.1 C82.1 C83.1 C84.1 C85.1 C86.1 C87.1 C88.1 C89.1 C90.1 C91.2 C92.1 C93.1 C94.1 C95.1 C96.1 C97.1 C98.1 C99.1 C100.1 C101.1 C102.1 C103.1 C104.1 C105.1 C106.1 C107.1 C108.1 C109.1 C110.1 C111.1 C112.1 C113.1 C114.1 C115.1 C116.1 C117.1 C118.1 C119.1 C120.1 C121.1 C122.1 C123.1 C124.1 C125.1 C235.1 C240.1 IC4.A2(GND) IC4.A3(GND) IC4.A5(GND) IC4.A7(GND) IC4.A9(GND) IC4.A11(GND) IC4.A12(GND) IC4.A22(GND) IC4.AA2(GND) IC4.AA12(GND) IC4.AA22(GND) IC4.AB9(GND) IC4.AB19(GND) IC4.B3(GND) IC4.B12(GND) IC4.B19(GND) IC4.C3(GND) IC4.C6(GND) IC4.C10(GND) IC4.C12(GND) IC4.C16(GND) IC4.D3(GND) IC4.D4(GND) IC4.D8(GND) IC4.D12(GND) IC4.D13(GND) IC4.E4(GND) IC4.E5(GND) IC4.E7(GND) IC4.E9(GND) IC4.E11(GND) IC4.E12(VCCBATT_0) IC4.E20(GND) IC4.F5(GND) IC4.F11(GND) IC4.F17(GND) IC4.G5(GND) IC4.G6(GND) IC4.G7(GND) IC4.G8(GND) IC4.G9(GND) IC4.G10(GND) IC4.G12(GND) IC4.G14(GND) IC4.H1(GND) IC4.H7(GND) IC4.H9(GND) IC4.H11(GND) IC4.H21(GND) IC4.J8(GND) IC4.J10(GND) IC4.J12(GND) IC4.J18(GND) IC4.K5(GND) IC4.K7(GND) IC4.K11(GND) IC4.K15(GND) IC4.L2(GND) IC4.L8(GND) IC4.L22(GND) IC4.M7(GND) IC4.M11(GND) IC4.M19(GND) IC4.N6(GND) IC4.N8(GND) IC4.N16(GND) IC4.P3(GND) IC4.P7(GND) IC4.P9(GND) IC4.P11(GND) IC4.P13(GND) IC4.R8(GND) IC4.R10(GND) IC4.R12(GND) IC4.R20(GND) IC4.T7(GND) IC4.T9(GND) IC4.T11(GND) IC4.T17(GND) IC4.U4(GND) IC4.U14(GND) IC4.V1(GND) IC4.V11(GND) IC4.V21(GND) IC4.W8(GND) IC4.W18(GND) IC4.Y5(GND) IC4.Y15(GND) J8.1 J8.3 J8.5 J8.7 J8.9 J8.11 L5.1 R47.1 R48.1 R54.2 R56.2 T4.2(S)
MGTAVCC: C57.2 C100.2 C123.2 C124.2 C125.2 IC4.D6(MGTAVCC) IC4.D10(MGTAVCC) IC4.E8(MGTAVCC) IC4.F7(MGTAVCC) IC4.F9(MGTAVCC)
MGTAVTT: C97.2 C101.2 C112.2 C113.2 C114.2 C115.2 C116.2 IC4.B5(MGTAVTT) IC4.B7(MGTAVTT) IC4.B9(MGTAVTT) IC4.B11(MGTAVTT) IC4.C4(MGTAVTT) IC4.C8(MGTAVTT)
P1V0: C91.1 C92.2 C93.2 C94.2 C95.2 C96.2 C102.2 C103.2 C104.2 C105.2 C106.2 C107.2 C108.2 C109.2 C110.2 IC4.H8(VCCINT) IC4.H10(VCCINT) IC4.J7(VCCINT) IC4.J9(VCCINT) IC4.K8(VCCINT) IC4.L7(VCCINT) IC4.M8(VCCINT) IC4.N7(VCCINT) IC4.P8(VCCINT) IC4.P10(VCCINT) IC4.R7(VCCINT) IC4.R9(VCCINT) IC4.T8(VCCINT) IC4.T10(VCCINT)
P1V5: C60.2 C64.2 C81.2 C82.2 C83.2 C84.2 C85.2 C240.2 IC4.C1(VCCO_35) IC4.F2(VCCO_35) IC4.H6(VCCO_35) IC4.J3(VCCO_35) IC4.M4(VCCO_35) IC4.N1(VCCO_35)
P1V8: L4.1
P2V5: C52.2 C54.2 C58.2 C61.2 C62.2 C63.2 C65.2 C66.2 C67.2 C68.2 C69.2 C70.2 C71.2 C72.2 C73.2 C74.2 C75.2 C76.2 C77.2 C78.2 C79.2 C80.2 C86.2 C87.2 C88.2 C89.2 C90.2 IC4.A17(VCCO_16) IC4.AA7(VCCO_34) IC4.AA17(VCCO_13) IC4.AB4(VCCO_34) IC4.AB14(VCCO_13) IC4.B14(VCCO_16) IC4.C21(VCCO_16) IC4.D18(VCCO_16) IC4.E15(VCCO_16) IC4.F12(VCCO_0) IC4.F22(VCCO_16) IC4.G19(VCCO_15) IC4.H16(VCCO_15) IC4.J13(VCCO_15) IC4.K20(VCCO_15) IC4.L17(VCCO_15) IC4.M14(VCCO_14) IC4.N21(VCCO_15) IC4.P18(VCCO_14) IC4.R5(VCCO_34) IC4.R15(VCCO_14) IC4.T2(VCCO_34) IC4.T12(VCCO_0) IC4.T22(VCCO_14) IC4.U8(CFGBVS_0) IC4.U19(VCCO_14) IC4.V6(VCCO_34) IC4.V16(VCCO_13) IC4.W3(VCCO_34) IC4.W13(VCCO_13) IC4.Y10(VCCO_13) IC4.Y20(VCCO_14) J8.2 R46.1 R52.1 R57.2 R58.2
P3V3: R55.2
VCCAUX: C55.2 C59.2 C98.2 C111.2 C117.2 C118.2 C119.2 C235.2 IC4.H12(VCCAUX) IC4.K12(VCCAUX) IC4.M12(VCCAUX) IC4.P12(VCCAUX) IC4.R11(VCCAUX)
VCCBRAM: C56.2 C99.2 C120.2 C121.2 C122.2 IC4.J11(VCCBRAM) IC4.L11(VCCBRAM) IC4.N11(VCCBRAM)
CFG_CCLK: IC4.L12(CCLK_0) ; port CFG_CCLK
CFG_TCK: IC4.V12(TCK_0) J8.6 ; port CFG_TCK
CFG_TDI: IC4.R13(TDI_0) J8.10 ; port CFG_TDI
CFG_TDO: IC4.U13(TDO_0) J8.8 ; port CFG_TDO
CFG_TMS: IC4.T13(TMS_0) J8.4 ; port CFG_TMS
DXN_0: IC4.N9(DXN_0) R56.1
DXP_0: IC4.N10(DXP_0) R54.1
FPGA_DONE: IC4.G11(DONE_0) R57.1 T4.1(G)
FPGA_INIT_B: IC4.U12(INIT_B_0) R53.2
RESETn: R53.1 ; port RESETN
XADC_GND: C50.1 C51.1 IC4.K9(GNDADC_0) IC4.L9(VREFN_0) IC4.L10(VP_0) IC4.M9(VN_0) IC4.M10(VREFP_0) L5.2
XADC_VCC: C50.2 C51.2 IC4.K10(VCCADC_0) L4.2
NetC53_2: C53.2 J8.13 R58.1 ; port EN_USB_JTAG
NetIC4_N12: IC4.N12(PROGRAM_B_0) R52.2
NetIC4_U9: IC4.U9(M2_0) R48.2
NetIC4_U10: IC4.U10(M1_0) R47.2
NetIC4_U11: IC4.U11(M0_0) R46.2
NetLD3_1: LD3.1(A) R55.1
NetLD3_2: LD3.2(C) T4.3(D)

Not connected (* = marked no-connect by the designer): J8 12* 14*

### Notes on the sheet
- (near IC4) TMS and TDI have internal pull-up resistors, as specified by IEEE Std 1149.1, as do TDO and TCK.
- 001-master SPI
- This pin (CFGVBS) selects the preconfiguration I/O standard type for the dedicated and multi-function configuration banks 0, 14, and 15. If the VCCO for banks 0, 14, or 15 is 2.5V or 3.3V, then this pin must be connect to VCCO_0. If the VCCO for banks 0, 14, and 15 are less than or equal to 1.8V, then this pin should be connected to GND.
- Project/Equipment
- Document
- Designer
- Drawn by
- Check.by
- File
- Last Mod.
- Print Date
- Sheet
- Size
- A3
- of
- Rev
- (in symbol CTE7343-19_330UF_2.5V_20%_LESR0025_KEMET_T520) +
- (in symbol KINGBRIGHT_KPTR-3216CGCK) Green
- (in symbol R0402_1K_1%_0.0625W_100PPM) 1%
- (in symbol R0402_1k_1%_0.0625W_100PPM) 1%
- (in symbol R0402_10K_1%_0.0625W_100PPM) 1%
- (in symbol R0402_300R_1%_0.0625W_100PPM) 1%

### Library data of the parts
C50 C57 C60 C101 C240 = CC0603_22UF_6.3V_20%_X5R: as C127 on sheet PowerSupplies; Part Number: CC0603_22UF_6.3V_20%_X5R; Component Kind: Standard; Component Type: Standard; Pin Count: 2; Value: 22uF; Status: None; Manufacturer Part Number: CC0603_22UF_6.3V_20%_X5R; Case: 0603; Mounted: Yes; Socket: No; SMD: Yes; Sense: No; Manufacturer1 Example: TDK; Manufacturer1 ComponentHeight: 1mm; HelpURL: \\cern.ch\dfs\Applications\Altium\Datasheets\CC0603_X5R_TDK_C.pdf; Author: CERN DEM JLC; CreateDate: 16.12.2013; LatestRevisionDate: 13.09.2016; ClassName: Artix
C51-C53 C112-C116 C120 C122-C125 = CC0201_100NF_6.3V_10%_X5R: as C134 on sheet PowerSupplies; Part Number: CC0201_100NF_6.3V_10%_X5R; Component Kind: Standard; Component Type: Standard; Pin Count: 2; Value: 100nF; Status: Not Recommended; Manufacturer Part Number: CC0201_100NF_6.3V_10%_X5R; Case: 0201; Mounted: Yes; Socket: No; SMD: Yes; Sense: No; Manufacturer1 Example: AVX; Manufacturer1 ComponentHeight: 0.33mm; HelpURL: \\cern.ch\dfs\Applications\Altium\Datasheets\CC0201_X5R_AVX.pdf; Author: CERN DEM JLC; CreateDate: 2007-12-03; LatestRevisionDate: 2007-12-03
  C51 C112-C116 C120 C122-C125: ClassName: Artix
  C52 C53: ClassName: FPGA_JTAG
C54 C235 = CC1210_47UF_10V_10%_X7R: as C147 on sheet PowerSupplies; Part Number: CC1210_47UF_10V_10%_X7R; Component Kind: Standard; Component Type: Standard; Pin Count: 2; Value: 47uF; Status: None; Manufacturer Part Number: CC1210_47UF_10V_10%_X7R; Case: 1210; Mounted: Yes; Socket: No; SMD: Yes; Sense: No; Manufacturer1 Example: MURATA; Manufacturer1 ComponentHeight: 2.7mm; HelpURL: \\cern.ch\dfs\Applications\Altium\Datasheets\CC1210_X7R_MURATA.pdf; Author: CERN DEM BC; CreateDate: 18.11.2015; LatestRevisionDate: 18.11.2015
C55 C61-C65 C68-C70 C73-C75 C78-C80 C83-C85 C88-C90 C95 C97-C100 C102-C108 C117-C119 C121 = CC0201_470NF_4V_20%_X5R: Non-polarised capacitor; Part Description: SMD Multilayer Chip Ceramic Capacitor; Manufacturer: GENERIC; Manufacturer1 Part Number: AMK063BJ474MP-F; Voltage: 4V; TC: X5R; Tolerance: ±20%; Part Number: CC0201_470NF_4V_20%_X5R; Component Kind: Standard; Component Type: Standard; Pin Count: 2; Value: 470nF; Status: Not Recommended; Manufacturer Part Number: CC0201_470NF_4V_20%_X5R; Case: 0201; Mounted: Yes; Socket: No; SMD: Yes; Sense: No; Manufacturer1 Example: TAIYO YUDEN; Manufacturer1 ComponentHeight: 0.33mm; HelpURL: \\cern.ch\dfs\Applications\Altium\Datasheets\CC0201_X5R_TAIYO-YUDEN_STANDARD-CLASS2.pdf; Author: CERN DEM JLC; CreateDate: 27.05.2010; LatestRevisionDate: 27.05.2010
  C61-C65 C95 C97-C100: ClassName: Artix
C56 C58 = CC1210_100UF_6.3V_20%_X5R: Non-polarised capacitor; Part Description: SMD Multilayer Chip Ceramic Capacitor; Manufacturer: GENERIC; Manufacturer1 Part Number: GRM32ER60J107ME20L; Voltage: 6.3V; TC: X5R; Tolerance: ±20%; Part Number: CC1210_100UF_6.3V_20%_X5R; Component Kind: Standard; Component Type: Standard; Pin Count: 2; Value: 100uF; Status: Preferred; Manufacturer Part Number: CC1210_100UF_6.3V_20%_X5R; Case: 1210; Mounted: Yes; Socket: No; SMD: Yes; Sense: No; Manufacturer1 Example: MURATA; Manufacturer1 ComponentHeight: 2.7mm; HelpURL: \\cern.ch\dfs\Applications\Altium\Datasheets\CC1210_X5R_MURATA.pdf; Author: CERN DEM JLC; CreateDate: 19.04.2010; LatestRevisionDate: 19.04.2010
C59 C66 C67 C71 C72 C76 C77 C81 C82 C86 C87 C92-C94 C96 C109-C111 = CC0805_4.7UF_10V_10%_X5R: Non-polarised capacitor; Manufacturer: GENERIC; Part Description: SMD Multilayer Chip Ceramic Capacitor; Manufacturer1 Part Number: 222224013672; Voltage: 10V; TC: X5R; Tolerance: ±10%; Part Number: CC0805_4.7UF_10V_10%_X5R; Component Kind: Standard; Component Type: Standard; Pin Count: 2; Value: 4.7uF; Status: Preferred; Manufacturer Part Number: CC0805_4.7UF_10V_10%_X5R; Case: 0805; Mounted: Yes; Socket: No; SMD: Yes; Sense: No; Manufacturer1 Example: PHYCOMP; Manufacturer1 ComponentHeight: 1.45mm; HelpURL: \\cern.ch\dfs\Applications\Altium\Datasheets\CC0805_X5R_PHYCOMP_HC.pdf; Author: CERN DEM JLC; CreateDate: 03.12.2007; LatestRevisionDate: 03.12.2007
C91 = CTE7343-19_330UF_2.5V_20%_LESR0025_KEMET_T520: Polarised capacitor; Part Description: Low ESR 0R025 Tantalum Chip Capacitor; Manufacturer: KEMET; Manufacturer Part Number: T520V337M2R5ATE025; Voltage: 2.5V; Tolerance: ±20%; Part Number: CTE7343-19_330UF_2.5V_20%_LESR0025_KEMET_T520; Component Kind: Standard; Component Type: Standard; Pin Count: 2; Value: 330uF; Status: None; Case: V; Mounted: Yes; Socket: No; SMD: Yes; Sense: No; ComponentHeight: 1.9mm; HelpURL: \\cern.ch\dfs\Applications\Altium\Datasheets\CTE-LESR_KEMET_T520.pdf; Author: CERN DEM MR; CreateDate: 23.03.2016; LatestRevisionDate: 23.03.2016
HS1 = Heat Sink No Pad: Heat Sink Without Pad; Manufacturer: Fischer Elektronik; Part Description: 23 x 23 x 10 mm, heatsink for IC design BGA and others; Manufacturer Part Number: ICK BGA 23 x 23 x 10; ComponentHeight: 10 mm; HelpURL: http://www.fischerelektronik.de/web_fischer/en_GB/heatsinks/B02/Heatsinks%20for%20BGAs/PR/ICKBGA23x23x10_/$productCard/parameters/datasheet.xhtml
IC4 = CMP-0364-00026-3: Artix-7 FPGA, 285 User I/Os, 4 GTP, 484-Ball BGA, Speed Grade 2, Commercial Grade, Pb-Free; Manufacturer: Xilinx; Max User I/O: 300; Clock Mgmt Tiles (CMTs): 6; Logic Cells: 101440; Block RAM Blocks (36Kb): 135; Block RAM Blocks (18Kb): 270; Speed Grade: -2; CLBs (Slices): 15850; Block RAM Blocks (Max Kb): 4860; DSP48E1 Slices: 240; RoHS: Pb-Free; ComponentLink3URL: http://www.xilinx.com/support/documentation/data_sheets/ds181_Artix_7_Data_Sheet.pdf; NexusDeviceID: XC7A100T-2FGG484C; DatasheetVersion: v1.12; Mounting Technology: Surface Mount; PackageDescription: Wire-Bond Fine-Pitch BGA, Body 23 x 23 mm, 1.0 mm Pitch; PackageReference: FGG484; ComponentLink2Description: Package Specification; Code_JEDEC: MS-034-AAJ-1; ComponentLink2URL: http://www.xilinx.com/support/documentation/user_guides/ug475_7Series_Pkg_Pinout.pdf; ComponentLink3Description: DC and Switching Characteristics; Generic Part Number: XC7A100T; ComponentLink4Description: Package File; ComponentLink4URL: http://www.xilinx.com/support/packagefiles/a7packages/xc7a100tfgg484pkg.txt; ComponentLink1URL: http://www.xilinx.com/support/documentation/data_sheets/ds180_7Series_Overview.pdf; PartNumber: XC7A100T-2FGG484C; ComponentLink5URL: http://www.xilinx.com/support/documentation/user_guides/ug475_7Series_Pkg_Pinout.pdf; PackageVersion: Rev 1.8; ComponentLink5Description: Packaging and Pinout; ComponentLink1Description: Datasheet; CLBs (Max Distributed RAM Kb): 1188; ClassName: Artix
J8 = MOLEX_87831-1420: Connector 14 Male; Part Description: 2.00mm (.079") Pitch Milli-Grid™ Header, Vertical, Shrouded, Center Polarization Slot, Locking Window, 14 Circuits; Manufacturer: MOLEX; PressFit: No; Part Number: MOLEX_87831-1420; Component Kind: Standard; Component Type: Standard; Pin Count: 14; Family: Milli-Grid™; Mounted: Yes; Socket: No; SMD: No; Sense: No; Status: None; Manufacturer Part Number: 87831-1420; ComponentHeight: 6.4mm; HelpURL: \\cern.ch\dfs\Applications\Altium\Datasheets\MOLEX_87831-1420.pdf; Author: CERN DEM JLC; CreateDate: 2010-04-13; LatestRevisionDate: 2010-04-13; ClassName: FPGA_JTAG
L4 L5 = IND0603_MURATA_BLM18SG121TN1D: as L7 on sheet PowerSupplies; Part Number: IND0603_MURATA_BLM18SG121TN1D; Component Kind: Standard; Component Type: Standard; Pin Count: 2; Value: 120R@100MHz; Status: None; Manufacturer Part Number: BLM18SG121TN1D; Case: 0603; Mounted: Yes; Socket: No; SMD: Yes; Sense: No; ComponentHeight: 0.65mm; HelpURL: \\cern.ch\dfs\Applications\Altium\Datasheets\IND0603_MURATA_BLM18S.pdf; Author: CERN DEM JLC; CreateDate: 23.07.2014; LatestRevisionDate: 23.07.2014; ClassName: Artix
LD3 = KINGBRIGHT_KPTR-3216CGCK: as LD4-LD10 on sheet PowerSupplies; ComponentHeight: 0.65mm; HelpURL: http://datasheet.octopart.com/KPH-1608CGCK-Kingbright-datasheet-62316526.pdf; Package Description: SMT Green LED, Case 0603, Body L 1.6 x W 0.8mm H 0.65mm
R46-R48 R53 R54 R56 = R0402_0R_JUMPER: Resistor; Part Description: 1A (0.05R Max DC Resistance) Zero Ohm Jumper; Manufacturer: GENERIC; Manufacturer1 Part Number: 232270591001L; PressFit: No; Part Number: R0402_0R_JUMPER; Component Kind: Standard; Component Type: Standard; Pin Count: 2; Value: 0; Status: Not Recommended; Manufacturer Part Number: R0402_0R_JUMPER; Case: 0402; Mounted: Yes; Sense: No; Socket: No; SMD: Yes; Manufacturer1 Example: YAGEO PHYCOMP; Manufacturer1 ComponentHeight: 0.4mm; HelpURL: \\cern.ch\dfs\Applications\Altium\Datasheets\R0402_Phycomp_RC0402.pdf; Author: CERN DEM JLC; CreateDate: 03.12.2007; LatestRevisionDate: 17.10.2012; ClassName: Artix
R52 = R0402_1K_1%_0.0625W_100PPM: Resistor - 1%; Part Description: General Purpose Thick Film Chip Resistor; Manufacturer: GENERIC; Manufacturer1 Part Number: 232270671002L; TC: ±100ppm/°C; PressFit: No; Part Number: R0402_1K_1%_0.0625W_100PPM; Component Kind: Standard; Component Type: Standard; Pin Count: 2; Value: 1k; Status: Not Recommended; Power: 0.0625W; Tolerance: ±1%; Manufacturer Part Number: R0402_1K_1%_0.0625W_100PPM; Case: 0402; Mounted: Yes; Sense: No; Socket: No; SMD: Yes; Manufacturer1 Example: YAGEO PHYCOMP; Manufacturer1 ComponentHeight: 0.4mm; HelpURL: \\cern.ch\dfs\Applications\Altium\Datasheets\R0402_Phycomp_RC0402.pdf; Author: CERN DEM JLC; CreateDate: 03.12.2007; LatestRevisionDate: 17.10.2012; ClassName: Artix
R55 = R0402_1k_1%_0.0625W_100PPM: as R82 on sheet PowerSupplies; Part Number: R0402_1K_1%_0.0625W_100PPM; Component Kind: Standard; Component Type: Standard; Pin Count: 2; Value: 1k; Status: Not Recommended; Power: 0.0625W; Tolerance: ±1%; Manufacturer Part Number: R0402_1K_1%_0.0625W_100PPM; Case: 0402; Mounted: Yes; Sense: No; Socket: No; SMD: Yes; Manufacturer1 Example: YAGEO PHYCOMP; Manufacturer1 ComponentHeight: 0.4mm; HelpURL: \\cern.ch\dfs\Applications\Altium\Datasheets\R0402_Phycomp_RC0402.pdf; Author: CERN DEM JLC; CreateDate: 03.12.2007; LatestRevisionDate: 17.10.2012; ClassName: Artix
R57 = R0402_300R_1%_0.0625W_100PPM: Resistor - 1%; Part Description: General Purpose Thick Film Chip Resistor; Manufacturer: GENERIC; Manufacturer1 Part Number: 232270673001L; TC: ±100ppm/°C; PressFit: No; Part Number: R0402_300R_1%_0.0625W_100PPM; Component Kind: Standard; Component Type: Standard; Pin Count: 2; Value: 300; Status: Not Recommended; Power: 0.0625W; Tolerance: ±1%; Manufacturer Part Number: R0402_300R_1%_0.0625W_100PPM; Case: 0402; Mounted: Yes; Sense: No; Socket: No; SMD: Yes; Manufacturer1 Example: YAGEO PHYCOMP; Manufacturer1 ComponentHeight: 0.4mm; HelpURL: \\cern.ch\dfs\Applications\Altium\Datasheets\R0402_Phycomp_RC0402.pdf; Author: CERN DEM JLC; CreateDate: 03.12.2007; LatestRevisionDate: 17.10.2012
R58 = R0402_10K_1%_0.0625W_100PPM: as R51 on sheet PowerSupplies; Part Number: R0402_10K_1%_0.0625W_100PPM; Component Kind: Standard; Component Type: Standard; Pin Count: 2; Value: 10k; Status: Not Recommended; Power: 0.0625W; Tolerance: ±1%; Manufacturer Part Number: R0402_10K_1%_0.0625W_100PPM; Case: 0402; Mounted: Yes; Sense: No; Socket: No; SMD: Yes; Manufacturer1 Example: YAGEO PHYCOMP; Manufacturer1 ComponentHeight: 0.4mm; HelpURL: \\cern.ch\dfs\Applications\Altium\Datasheets\R0402_Phycomp_RC0402.pdf; Author: CERN DEM JLC; CreateDate: 03.12.2007; LatestRevisionDate: 17.10.2012; ClassName: FPGA_JTAG
T4 = BSH103: as T6-T10 on sheet PowerSupplies; Part Number: BSH103; Component Kind: Standard; Component Type: Standard; Device: BSH103; PackageDescription: SOT23, 3 pin, Pitch 0.95mm - 1.3mm W X 2.9mm L X 1.1mm H, IPC Medium Density; Manufacturer Part Number: BSH103; Pin Count: 3; Case: SOT23-3; Mounted: Yes; Socket: No; SMD: Yes; Sense: No; ComponentHeight: 1.1mm; HelpURL: \\cern.ch\dfs\Applications\Altium\Datasheets\BSH103.pdf; Author: CERN DEM JLC; CreateDate: 16.03.2010; LatestRevisionDate: 20.06.2017; ClassName: Artix

## Sheet FPGAGTP.SchDoc: =ProjectName
size 420 x 297 mm; Author: G.K.; CompanyName: WUT; DrawnBy: P.K.; Organization: WUT ISE; Address1: Warsaw Univeristy of Technology; Address2: Nowowiejska 15/19; DocumentNumber: 10; Revision: 1.1; SheetNumber: 10; SheetTotal: 12; EDA_Number: ARTIQ; Projet: ARTIQ/SINARA; ModifiedBy: -; CreateDate: XX/XX/XXXX; CheckedDate: -; Title2: FPGAGTP.SchDoc; DivGrp: ISE; Designer: P.K.; ModifiedDate: -; ProjectName: ARTIQ/SINARA
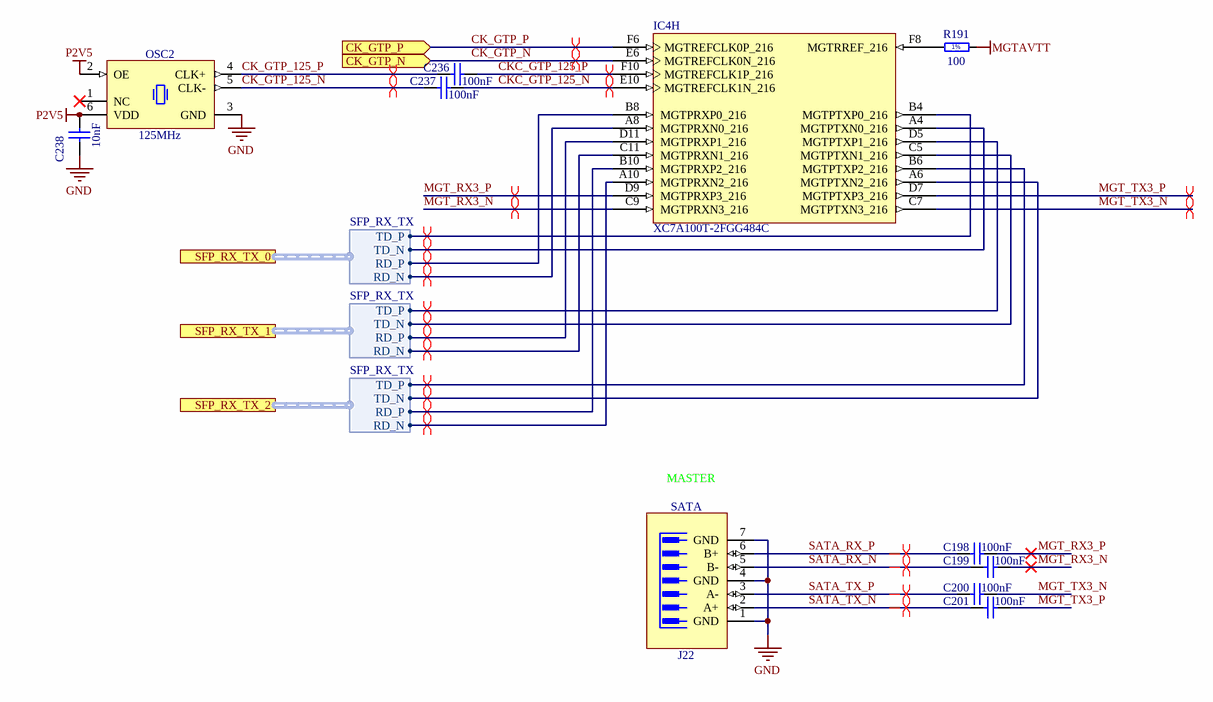
[diagram p7: FPGAGTP.SchDoc]

### Parts
C198  100nF  [CAPC0603X33N]
C199  100nF  [CAPC0603X33N]
C200  100nF  [CAPC0603X33N]
C201  100nF  [CAPC0603X33N]
C236  100nF  [CAPC0603X33N]
C237  100nF  [CAPC0603X33N]
C238  10nF  [CAPC1005X55N]
IC4  XC7A100T-2FGG484C  [FGG484]  (part H of 10)
J22  SATA  [MOLEX_67800-5005]
OSC2  125MHz  [OSC_SILICON-LAB_SI510-6N]
R191  100  [RESC1005X40N]

### Ports
CK_GTP_N (in), CK_GTP_P (in), SFP_RX_TX_0 (harness SFP_RX_TX), SFP_RX_TX_1 (harness SFP_RX_TX), SFP_RX_TX_2 (harness SFP_RX_TX)

### Harnesses
SFP_RX_TX: RD_N, RD_P, TD_N, TD_P

### Nets
GND: C238.1 J22.1(GND) J22.4(GND) J22.7(GND) OSC2.3(GND)
MGTAVTT: R191.1
P2V5: C238.2 OSC2.2(OE) OSC2.6(VDD)
CK_GTP_125_N: C237.1 OSC2.5(CLK-)
CK_GTP_125_P: C236.1 OSC2.4(CLK+)
CK_GTP_N: IC4.E6(MGTREFCLK0N_216) ; port CK_GTP_N
CK_GTP_P: IC4.F6(MGTREFCLK0P_216) ; port CK_GTP_P
CKC_GTP_125_N: C237.2 IC4.E10(MGTREFCLK1N_216)
CKC_GTP_125_P: C236.2 IC4.F10(MGTREFCLK1P_216)
MGT_RX3_N: C199.2 IC4.C9(MGTPRXN3_216)
MGT_RX3_P: C198.2 IC4.D9(MGTPRXP3_216)
MGT_TX3_N: C200.2 IC4.C7(MGTPTXN3_216)
MGT_TX3_P: C201.2 IC4.D7(MGTPTXP3_216)
SATA_RX_N: C199.1 J22.5(B-)
SATA_RX_P: C198.1 J22.6(B+)
SATA_TX_N: C201.1 J22.2(A+)
SATA_TX_P: C200.1 J22.3(A-)
SFP_RX_TX_0.RD_N: IC4.A8(MGTPRXN0_216) ; port SFP_RX_TX_0.RD_N
SFP_RX_TX_0.RD_P: IC4.B8(MGTPRXP0_216) ; port SFP_RX_TX_0.RD_P
SFP_RX_TX_0.TD_N: IC4.A4(MGTPTXN0_216) ; port SFP_RX_TX_0.TD_N
SFP_RX_TX_0.TD_P: IC4.B4(MGTPTXP0_216) ; port SFP_RX_TX_0.TD_P
SFP_RX_TX_1.RD_N: IC4.C11(MGTPRXN1_216) ; port SFP_RX_TX_1.RD_N
SFP_RX_TX_1.RD_P: IC4.D11(MGTPRXP1_216) ; port SFP_RX_TX_1.RD_P
SFP_RX_TX_1.TD_N: IC4.C5(MGTPTXN1_216) ; port SFP_RX_TX_1.TD_N
SFP_RX_TX_1.TD_P: IC4.D5(MGTPTXP1_216) ; port SFP_RX_TX_1.TD_P
SFP_RX_TX_2.RD_N: IC4.A10(MGTPRXN2_216) ; port SFP_RX_TX_2.RD_N
SFP_RX_TX_2.RD_P: IC4.B10(MGTPRXP2_216) ; port SFP_RX_TX_2.RD_P
SFP_RX_TX_2.TD_N: IC4.A6(MGTPTXN2_216) ; port SFP_RX_TX_2.TD_N
SFP_RX_TX_2.TD_P: IC4.B6(MGTPTXP2_216) ; port SFP_RX_TX_2.TD_P
NetIC4_F8: IC4.F8(MGTRREF_216) R191.2

Not connected (* = marked no-connect by the designer): OSC2 1(NC)*

### Layout directives
differential pair: CK_GTP_N, CK_GTP_P, SFP_RX_TX_0.RD_N, SFP_RX_TX_0.RD_P, SFP_RX_TX_0.TD_N, SFP_RX_TX_0.TD_P, SFP_RX_TX_1.RD_N, SFP_RX_TX_1.RD_P, SFP_RX_TX_1.TD_N, SFP_RX_TX_1.TD_P, SFP_RX_TX_2.RD_N, SFP_RX_TX_2.RD_P, SFP_RX_TX_2.TD_N, SFP_RX_TX_2.TD_P
differential pair; net class Diff_100Ohm: CK_GTP_125_N, CK_GTP_125_P, CKC_GTP_125_N, CKC_GTP_125_P, MGT_RX3_N, MGT_RX3_P, MGT_TX3_N, MGT_TX3_P, SATA_RX_N, SATA_RX_P, SATA_TX_N, SATA_TX_P

### Notes on the sheet
- MASTER
- Project/Equipment
- Document
- Designer
- Drawn by
- Check.by
- File
- Last Mod.
- Print Date
- Sheet
- Size
- A3
- of
- Rev
- (in symbol R0402_100R_1%_0.0625W_100PPM) 1%

### Library data of the parts
C198-C201 C236 C237 = CC0201_100NF_6.3V_10%_X5R: as C134 on sheet PowerSupplies; Part Number: CC0201_100NF_6.3V_10%_X5R; Component Kind: Standard; Component Type: Standard; Pin Count: 2; Value: 100nF; Status: Not Recommended; Manufacturer Part Number: CC0201_100NF_6.3V_10%_X5R; Case: 0201; Mounted: Yes; Socket: No; SMD: Yes; Sense: No; Manufacturer1 Example: AVX; Manufacturer1 ComponentHeight: 0.33mm; HelpURL: \\cern.ch\dfs\Applications\Altium\Datasheets\CC0201_X5R_AVX.pdf; Author: CERN DEM JLC; CreateDate: 2007-12-03; LatestRevisionDate: 2007-12-03
  C198-C201: ClassName: SATA
C238 = CC0402_10NF_16V_10%_X7R: Non-polarised capacitor; Part Description: SMD Multilayer Chip Ceramic Capacitor; Manufacturer: GENERIC; Manufacturer1 Part Number: 223878715636; Voltage: 16V; TC: X7R; Tolerance: ±10%; Part Number: CC0402_10NF_16V_10%_X7R; Component Kind: Standard; Component Type: Standard; Pin Count: 2; Value: 10nF; Status: Not Recommended; Manufacturer Part Number: CC0402_10NF_16V_10%_X7R; Case: 0402; Mounted: Yes; Socket: No; SMD: Yes; Sense: No; Manufacturer1 Example: PHYCOMP; Manufacturer1 ComponentHeight: 0.55mm; HelpURL: \\cern.ch\dfs\Applications\Altium\Datasheets\CC0402_X7R_PHYCOMP.pdf; Author: CERN DEM JLC; CreateDate: 03.12.2007; LatestRevisionDate: 03.12.2007
IC4 = CMP-0364-00026-3: as IC4 on sheet FPGAPower&Misc; RoHS: Pb-Free; ComponentLink3URL: http://www.xilinx.com/support/documentation/data_sheets/ds181_Artix_7_Data_Sheet.pdf; NexusDeviceID: XC7A100T-2FGG484C; DatasheetVersion: v1.12; Mounting Technology: Surface Mount; PackageDescription: Wire-Bond Fine-Pitch BGA, Body 23 x 23 mm, 1.0 mm Pitch; PackageReference: FGG484; ComponentLink2Description: Package Specification; Code_JEDEC: MS-034-AAJ-1; ComponentLink2URL: http://www.xilinx.com/support/documentation/user_guides/ug475_7Series_Pkg_Pinout.pdf; ComponentLink3Description: DC and Switching Characteristics; Generic Part Number: XC7A100T; ComponentLink4Description: Package File; ComponentLink4URL: http://www.xilinx.com/support/packagefiles/a7packages/xc7a100tfgg484pkg.txt; ComponentLink1URL: http://www.xilinx.com/support/documentation/data_sheets/ds180_7Series_Overview.pdf; PartNumber: XC7A100T-2FGG484C; ComponentLink5URL: http://www.xilinx.com/support/documentation/user_guides/ug475_7Series_Pkg_Pinout.pdf; PackageVersion: Rev 1.8; ComponentLink5Description: Packaging and Pinout; ComponentLink1Description: Datasheet; CLBs (Max Distributed RAM Kb): 1188; ClassName: Artix
J22 = MOLEX_67800-5005: 7 Pin SATA Receptacle; Part Description: 1.27mm Pitch, 7 Contacts, Serial ATA High Speed Header, Straight with Locking Latch; Manufacturer: MOLEX; PressFit: No; Part Number: MOLEX_67800-5005; Component Kind: Standard; Component Type: Standard; Pin Count: 7; Family: SATA; Mounted: Yes; Socket: No; SMD: Yes; Sense: No; Status: None; Manufacturer Part Number: 67800-5005; ComponentHeight: 8.4mm; HelpURL: \\cern.ch\dfs\Applications\Altium\Datasheets\MOLEX_67800-5005.pdf; Author: CERN DEM MR; CreateDate: 01.12.2016; LatestRevisionDate: 01.12.2016; ClassName: SATA
OSC2 = OSC_125MHZ_SILICON-LAB_510FBA125M000AAG: Crystal Oscillator 6 pins, Si510 (LVDS/LVPECL/HCSL/Dual CMOS); Part Description: 2.5V ±25ppm LVDS Crystal Oscillator (XO), Si510 Series; Manufacturer: SILICON LABS; PressFit: No; Bonding: No; Part Number: OSC_125MHZ_SILICON-LAB_510FBA125M000AAG; Component Kind: Standard; Component Type: Standard; PackageDescription: Oscillator Si510 Series, 6 pins, 5x7mm; Value: 125MHz; Manufacturer Part Number: 510FBA125M000AAG; Pin Count: 6; Mounted: Yes; Socket: No; SMD: Yes; Sense: No; ComponentHeight: 1.8mm; HelpURL: \\cern.ch\dfs\Applications\Altium\Datasheets\OSC_SILICON-LAB_SI510.pdf; Author: CERN DEM JMW; CreateDate: 2015-08-10; LatestRevisionDate: 2015-08-10
R191 = R0402_100R_1%_0.0625W_100PPM: Resistor - 1%; Part Description: General Purpose Thick Film Chip Resistor; Manufacturer: GENERIC; Manufacturer1 Part Number: 232270671001L; TC: ±100ppm/°C; PressFit: No; Part Number: R0402_100R_1%_0.0625W_100PPM; Component Kind: Standard; Component Type: Standard; Pin Count: 2; Value: 100; Status: Not Recommended; Power: 0.0625W; Tolerance: ±1%; Manufacturer Part Number: R0402_100R_1%_0.0625W_100PPM; Case: 0402; Mounted: Yes; Sense: No; Socket: No; SMD: Yes; Manufacturer1 Example: YAGEO PHYCOMP; Manufacturer1 ComponentHeight: 0.4mm; HelpURL: \\cern.ch\dfs\Applications\Altium\Datasheets\R0402_Phycomp_RC0402.pdf; Author: CERN DEM JLC; CreateDate: 03.12.2007; LatestRevisionDate: 17.10.2012; ClassName: Artix